# Altium schematic sheet PowerDriver.SchDoc: 3D Printer Power Driver
size A; Author: Łukasz Weber
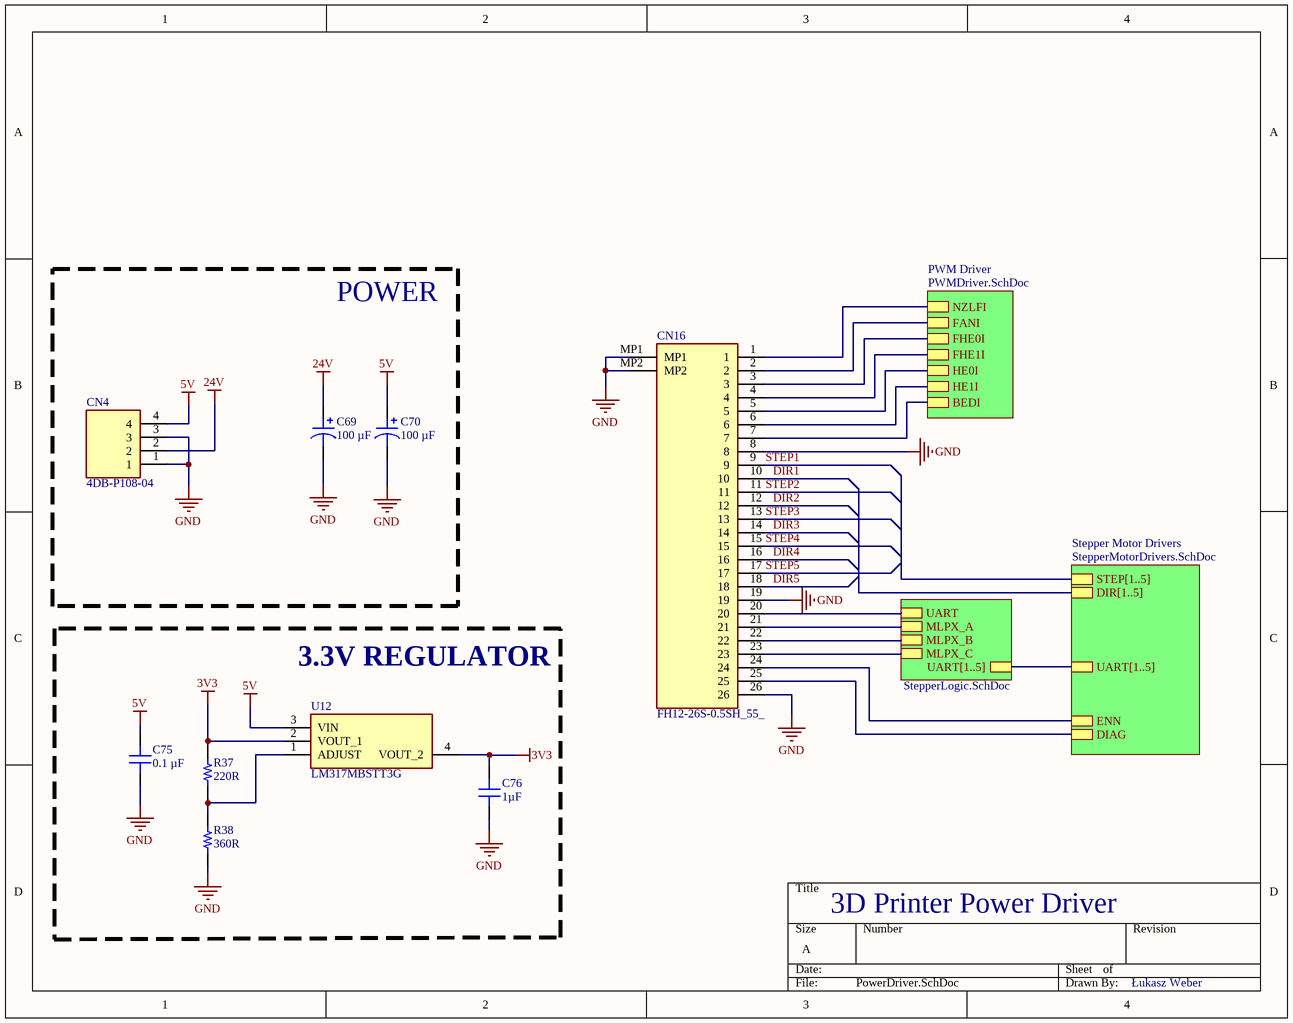
[diagram p0: PowerDriver.SchDoc]

## Parts
C69  100 µF  [CAP ALSMD 6.6MM H7.7MM]
C70  100 µF  [CAP ALSMD 6.6MM H7.7MM]
C75  0.1 µF  [CAP 0603_1608]
C76  1µF  [CAP 0603_1608]
CN4  4DB-P108-04  [SHDR4W132P0X826_1X4_3467X1270X1346P]
CN16  FH12-26S-0.5SH_55_  [FH1226S05SH55]
R37  220R  [RES 0603_1608]
R38  360R  [RES 0603_1608]
U12  LM317MBSTT3G  [SOT230P700X175-4N]

## Blocks framed on the sheet
POWER: C69 C70 CN4
3.3V REGULATOR: C75 C76 R37 R38 U12

## Sub-sheets
PWM Driver = PWMDriver.SchDoc: FHE1I, HE0I, BEDI, FANI, NZLFI, FHE0I, HE1I
Stepper Logic = StepperLogic.SchDoc: UART, MLPX_C, MLPX_A, MLPX_B, UART[1..5]
Stepper Motor Drivers = StepperMotorDrivers.SchDoc: STEP[1..5], DIAG, UART[1..5], DIR[1..5], ENN

## Nets
3V3: C76.2 R37.2 U12.2(VOUT_1) U12.4(VOUT_2)
5V: C70.1 C75.2 CN4.4 U12.3(VIN)
24V: C69.1 CN4.2
GND: C69.2 C70.2 C75.1 C76.1 CN4.1 CN4.3 CN16.8 CN16.19 CN16.26 CN16.MP1 CN16.MP2 R38.1
DIR1: CN16.10
DIR2: CN16.12
DIR3: CN16.14
DIR4: CN16.16
DIR5: CN16.18
STEP1: CN16.9
STEP2: CN16.11
STEP3: CN16.13
STEP4: CN16.15
STEP5: CN16.17
NetCN16_1: CN16.1 ; sheet PWM Driver/NZLFI
NetCN16_2: CN16.2 ; sheet PWM Driver/FANI
NetCN16_3: CN16.3 ; sheet PWM Driver/FHE0I
NetCN16_4: CN16.4 ; sheet PWM Driver/FHE1I
NetCN16_5: CN16.5 ; sheet PWM Driver/HE0I
NetCN16_6: CN16.6 ; sheet PWM Driver/HE1I
NetCN16_7: CN16.7 ; sheet PWM Driver/BEDI
NetCN16_20: CN16.20 ; sheet Stepper Logic/UART
NetCN16_21: CN16.21 ; sheet Stepper Logic/MLPX_A
NetCN16_22: CN16.22 ; sheet Stepper Logic/MLPX_B
NetCN16_23: CN16.23 ; sheet Stepper Logic/MLPX_C
NetCN16_24: CN16.24 ; sheet Stepper Motor Drivers/ENN
NetCN16_25: CN16.25 ; sheet Stepper Motor Drivers/DIAG
NetR37_1: R37.1 R38.2 U12.1(ADJUST)

## Buses and harness runs
bus sheet Stepper Logic/UART[1..5] = sheet Stepper Motor Drivers/UART[1..5]

## Notes on the sheet
- 3D Printer Power Driver
- Łukasz Weber

## Library data of the parts
C69 C70 = UWT1E101MCL1GS: CAP ALUM 100UF 20% 25V SMD; manufacturer: Nichicon; Lifetime @ Temp.: 1000 Hrs @ 105°C; Polarization: Polar; Ripple Current @ High Frequency: 136.5 mA @ 10 kHz; Ripple Current @ Low Frequency: 91 mA @ 120 Hz; Surface Mount Land Size: 0.260" L x 0.260" W (6.60mm x 6.60mm); Part Number: UWT1E101MCL1GS; Applications: General Purpose; Capacitance: 100 µF; componentlink1description: Datasheet; componentlink1url: https://products.nichicon.co.jp/en/pdf/XJA043/e-uwt.pdf; componentlink2description: DigiKey Link; componentlink2url: https://www.digikey.com/en/products/detail/nichicon/UWT1E101MCL1GS/589931; Device Package: Radial, Can - SMD; Height - Seated (Max): 0.303" (7.70mm); lastupdated: 6/18/2023 8:45:36 PM; Lifecycle Status: Active; Minimum Order: 1; Mounting Type: Surface Mount; Operating Temperature: -55°C ~ 105°C; Package / Case: Radial, Can - SMD; packaging: TapeAndReel; partid: 27222; Part Status: Active; price: 0.10; series: UWT; Size / Dimension: 0.248" Dia (6.30mm); Supplier 1: DigiKey; Supplier Part Number 1: 493-2190-1-ND; Tolerance: ±20%; value: 100 µF; Voltage - Rated: 25 V
C75 = 0603B104K101CT: CAP CER 0.1UF 100V X7R 0603; manufacturer: Walsin Technology Corporation; Tolerance: ±10%; Part Number: 0603B104K101CT; Value: 0.1 µF; Applications: General Purpose; Capacitance: 0.1 µF; componentlink1description: Datasheet; componentlink1url: http://www.passivecomponent.com/wp-content/uploads/2018/10/MLCC.pdf; componentlink2description: DigiKey Link; componentlink2url: https://www.digikey.com/en/products/detail/walsin-technology-corporation/0603B104K101CT/9354889; Device Package: 0603 (1608 Metric); lastupdated: 4/8/2023 7:09:18 PM; Lifecycle Status: Active; Minimum Order: 1; Mounting Type: Surface Mount, MLCC; Operating Temperature: -55°C ~ 125°C; Package / Case: 0603 (1608 Metric); packaging: TapeAndReel; partid: 4273; Part Status: Active; price: 0.01; series: -; Size / Dimension: 0.063" L x 0.031" W (1.60mm x 0.80mm); Supplier 1: DigiKey; Supplier Part Number 1: 1292-1392-1-ND; Temperature Coefficient: X7R; Thickness (Max): 0.037" (0.95mm); Voltage - Rated: 100V
C76 = 0603YD105KAT4A: CAP CER 1UF 16V X5R 0603; manufacturer: AVX Corporation; Tolerance: ±10%; Part Number: 0603YD105KAT4A; Value: 1µF; Applications: General Purpose; Capacitance: 1µF; componentlink1description: Datasheet; componentlink1url: http://datasheets.avx.com/cx5r.pdf; componentlink2description: DigiKey Link; componentlink2url: http://digikey.com/product-detail/en/avx-corporation/0603YD105KAT4A/478-10365-1-ND/6797443; Device Package: 0603 (1608 Metric); lastupdated: 9/2/2020 1:03:10 AM; Lifecycle Status: Active; Minimum Order: 1; Mounting Type: Surface Mount, MLCC; Operating Temperature: -55°C ~ 85°C; Package / Case: 0603 (1608 Metric); packaging: TapeAndReel; partid: 15257; Part Status: Active; price: 0.03; series: -; Size / Dimension: 0.063" L x 0.032" W (1.60mm x 0.81mm); Supplier 1: DigiKey; Supplier Part Number 1: 478-10365-1-ND; Temperature Coefficient: X5R; Thickness (Max): 0.035" (0.90mm); Voltage - Rated: 16V
CN4 = 4DB-P108-04: Connector; Manufacturer_Name: TE Connectivity; Datasheet Link: https://www.te.com/commerce/DocumentDelivery/DDEController?Action=srchrtrv&DocNm=2-1437667-4&DocType=Customer+Drawing&DocLang=English; Height: 13.462mm; Manufacturer_Part_Number: 4DB-P108-04; Mouser Part Number: 571-214376676; Mouser Price/Stock: https://www.mouser.co.uk/ProductDetail/TE-Connectivity/4DB-P108-04?qs=JZD3Rbs9XzlqoR88q1UQbw%3D%3D; Arrow Part Number: 4DB-P108-04; Arrow Price/Stock: https://www.arrow.com/en/products/4db-p108-04/te-connectivity?region=nac
CN16 = FH12-26S-0.5SH_55_: Connector; Manufacturer_Name: Hirose; Manufacturer_Part_Number: FH12-26S-0.5SH(55); Datasheet Link: https://datasheet.datasheetarchive.com/originals/distributors/SFDatasheet-1/sf-00023459.pdf; Height: 2.2mm; Mouser Part Number: 798-FH12-26S-0.5SH55; Mouser Price/Stock: https://www.mouser.co.uk/ProductDetail/Hirose-Connector/FH12-26S-0.5SH55?qs=Ux3WWAnHpjC%2FipJJsmJDaQ%3D%3D; Arrow Part Number: FH12-26S-0.5SH(55); Arrow Price/Stock: https://www.arrow.com/en/products/fh12-26s-0.5sh-55/hirose-electric
R37 = RCS0603240RFKEA: RES SMD 240 OHM 1% 1/4W 0603; Manufacturer: Vishay Dale; Power (Watts): 0.25W, 1/4W; Resistance: 240 Ohms; Temperature Coefficient: ±100ppm/°C; Part Number: RCS0603240RFKEA; Value: 220R; ComponentLink1Description: Datasheet; ComponentLink1URL: https://www.vishay.com/docs/20065/rcse3.pdf; ComponentLink2Description: DigiKey Link; ComponentLink2URL: https://www.digikey.com/en/products/detail/vishay-dale/RCS0603240RFKEA/5868414; Composition: Thick Film; Device Package: 0603 (1608 Metric); Features: Automotive AEC-Q200, Pulse Withstanding; Height - Seated (Max): 0.020" (0.50mm); LastUpdated: 4/8/2023 7:29:03 PM; Lifecycle Status: Active; Minimum Order: 1; Number of Terminations: 2; Operating Temperature: -55°C ~ 155°C; Package / Case: 0603 (1608 Metric); Packaging: TapeAndReel; PartId: 62490; Part Status: Active; Price: 0.02; Ratings: AEC-Q200; Series: RCS e3; Size / Dimension: 0.061" L x 0.033" W (1.55mm x 0.85mm); Supplier 1: DigiKey; Supplier Part Number 1: 541-RCS0603240RFKEACT-ND; Supplier Device Package: 0603; Tolerance: ±1%
R38 = ESR03EZPJ202: RES SMD 2K OHM 5% 1/4W 0603; Manufacturer: Rohm Semiconductor; Power (Watts): 0.25W, 1/4W; Resistance: 2 kOhms; Temperature Coefficient: ±200ppm/°C; Part Number: ESR03EZPJ202; Value: 360R; ComponentLink1Description: Datasheet; ComponentLink1URL: https://www.rohm.com/datasheet/ESR01MZPF/esr-e; ComponentLink2Description: DigiKey Link; ComponentLink2URL: https://www.digikey.com/en/products/detail/rohm-semiconductor/ESR03EZPJ202/1762725; Composition: Thick Film; Device Package: 0603 (1608 Metric); Features: Automotive AEC-Q200, Pulse Withstanding; Height - Seated (Max): 0.022" (0.55mm); LastUpdated: 4/8/2023 7:30:16 PM; Lifecycle Status: Active; Minimum Order: 1; Number of Terminations: 2; Operating Temperature: -55°C ~ 155°C; Package / Case: 0603 (1608 Metric); Packaging: TapeAndReel; PartId: 16457; Part Status: Active; Price: 0.01; Ratings: AEC-Q200; Series: ESR; Size / Dimension: 0.063" L x 0.031" W (1.60mm x 0.80mm); Supplier 1: DigiKey; Supplier Part Number 1: RHM2.0KDCT-ND; Supplier Device Package: 0603; Tolerance: ±5%
U12 = LM317MBSTT3G: Integrated Circuit; Manufacturer_Name: onsemi; Datasheet Link: http://www.farnell.com/datasheets/2058184.pdf; Height: 1.75mm; Manufacturer_Part_Number: LM317MBSTT3G; Mouser Part Number: 863-LM317MBSTT3G; Mouser Price/Stock: https://www.mouser.co.uk/ProductDetail/onsemi/LM317MBSTT3G?qs=2OtswVQKCOFxsFzIc5DGlw%3D%3D; Arrow Part Number: LM317MBSTT3G; Arrow Price/Stock: https://www.arrow.com/en/products/lm317mbstt3g/on-semiconductor?region=nac